# Altium schematic sheet PressureSensor.SchDoc
size Letter
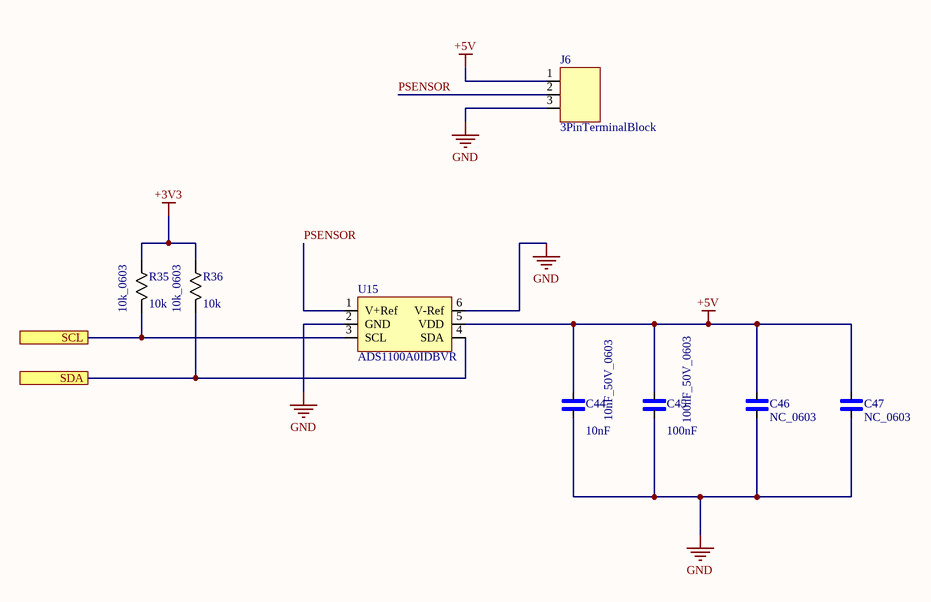
[diagram p0: PressureSensor.SchDoc]

## Parts
C44  10nF_50V_0603  Capacitance: 10nF  [0603]
C45  100nF_50V_0603  Capacitance: 100nF  [0603]
C46  NC_0603  [0603]
C47  NC_0603  [0603]
J6  3PinTerminalBlock  [3 POS 5mm Pitch]
R35  10k_0603  Resistance: 10k  [0603]
R36  10k_0603  Resistance: 10k  [0603]
U15  ADS1100A0IDBVR  [ADS1100A0IDBVR]

## Ports
SCL, SDA

## Nets
+3V3: R35.2 R36.2
+5V: C44.2 C45.2 C46.2 C47.2 J6.1 U15.5(VDD)
GND: C44.1 C45.1 C46.1 C47.1 J6.3 U15.2(GND) U15.6(V-Ref)
PSENSOR: J6.2 U15.1(V+Ref)
SCL: R35.1 U15.3(SCL) ; port SCL
SDA: R36.1 U15.4(SDA) ; port SDA

## Library data of the parts
C44 = 10nF_50V_0603: Manufacturer: Murata; Manufacturer Part Number: GRM188R71H103KA01D; Dielectric Material: Ceramic; Voltage Rating: 50V; Tolerance: 10%; Dielectric: X7R; Insulation Resistance: 10GR; Supplier 1: Digi-Key; Stock 1: 0; Pricing 1: 1=0.1, 10=0.06, 100=0.0266, 500=0.019 (USD); Mount: Surface Mount; Case/Package: 0603; Number of Pins: 2; Case Code (Metric): 1608; Case Code (Imperial): 0603; Material: Ceramic; Min Operating Temperature: -55°C; Max Operating Temperature: 125°C; Packaging: Tape and Reel; Voltage Rating (DC): 50V; Package Quantity: 1; Termination: SMD/SMT; Voltage: 50V; Length: 1.6mm; Height: 0.8mm; Width: 0.031inch; Thickness: 0.035inch; Depth: 0.8mm; REACH SVHC: Unknown; Lead Free: Lead Free; ComponentLink1URL: https://datasheet.ciiva.com/129/product-129872.pdf; ComponentLink1Description: https://datasheet.ciiva.com/129/product-129872.pdf; ComponentLink2URL: https://datasheet.ciiva.com/11786/0900766b8003061f-11786516.pdf; ComponentLink2Description: https://datasheet.ciiva.com/11786/0900766b8003061f-11786516.pdf; ComponentLink3URL: https://datasheet.ciiva.com/7937/4360-7937654.pdf; ComponentLink3Description: https://datasheet.ciiva.com/7937/4360-7937654.pdf; ComponentLink4URL: https://datasheet.ciiva.com/7937/1747461-7937655.pdf; ComponentLink4Description: https://datasheet.ciiva.com/7937/1747461-7937655.pdf; ComponentLink5URL: https://datasheet.ciiva.com/7937/1747461-7937656.pdf; ComponentLink5Description: https://datasheet.ciiva.com/7937/1747461-7937656.pdf; ComponentLink6URL: https://datasheet.ciiva.com/28534/1769893-28534235.pdf; ComponentLink6Description: https://datasheet.ciiva.com/28534/1769893-28534235.pdf; ComponentLink7URL: https://datasheet.ciiva.com/129/partnumbering-e-01-129870.pdf; ComponentLink7Description: https://datasheet.ciiva.com/129/partnumbering-e-01-129870.pdf; ComponentLink8URL: https://datasheet.ciiva.com/48428/nmgrm-data-en-48428590.pdf; ComponentLink8Description: https://datasheet.ciiva.com/48428/nmgrm-data-en-48428590.pdf; ComponentLink9URL: https://datasheet.ciiva.com/129/partnumbering-e-01-129871.pdf; ComponentLink9Description: https://datasheet.ciiva.com/129/partnumbering-e-01-129871.pdf; ComponentLink10URL: https://datasheet.ciiva.com/48428/nmgrm-data-en-48428591.pdf; ComponentLink10Description: https://datasheet.ciiva.com/48428/nmgrm-data-en-48428591.pdf; ComponentLink11URL: https://datasheet.ciiva.com/29202/451715-da-01-en-vs-kondensator-0603-29202047.pdf; ComponentLink11Description: https://datasheet.ciiva.com/29202/451715-da-01-en-vs-kondensator-0603-29202047.pdf; Supplier Part Number 1: 490-1512-1-ND
C45 = 100nF_50V_0603: Manufacturer: Murata; Manufacturer Part Number: GRM188R71H104KA93D; Material: Ceramic; Tolerance: 10%; Voltage Rating: 50V; Dielectric: X7R; Insulation Resistance: 10GR; Supplier 1: Digi-Key; Stock 1: 0; Pricing 1: 1=0.12, 10=0.084, 100=0.0396, 500=0.02778, 1000=0.023 (USD); Mount: Surface Mount; Case/Package: 0603; Number of Pins: 2; Case Code (Imperial): 0603; Case Code (Metric): 1608; Dielectric Material: Ceramic; Contact Plating: Tin,Matte; Min Operating Temperature: -55°C; Max Operating Temperature: 125°C; Packaging: Tape and Reel; Voltage Rating (DC): 50V; Package Quantity: 1; Termination: SMD/SMT; Voltage: 50V; Length: 1.6mm; Height: 0.8mm; Width: 0.8mm; Thickness: 0.035inch; Depth: 0.8mm; Radiation Hardening: No; REACH SVHC: No SVHC; Lead Free: Lead Free; ComponentLink1URL: https://datasheet.ciiva.com/19467/1857604-19467681.pdf; ComponentLink1Description: https://datasheet.ciiva.com/19467/1857604-19467681.pdf; ComponentLink2URL: https://datasheet.ciiva.com/28534/4360-28534245.pdf; ComponentLink2Description: https://datasheet.ciiva.com/28534/4360-28534245.pdf; ComponentLink3URL: https://datasheet.ciiva.com/26915/getdatasheetpartid-89095-26915384.pdf; ComponentLink3Description: https://datasheet.ciiva.com/26915/getdatasheetpartid-89095-26915384.pdf; ComponentLink4URL: https://datasheet.ciiva.com/131/partnumbering-e-01-131738.pdf; ComponentLink4Description: https://datasheet.ciiva.com/131/partnumbering-e-01-131738.pdf; ComponentLink5URL: https://datasheet.ciiva.com/7937/1747470-7937658.pdf; ComponentLink5Description: https://datasheet.ciiva.com/7937/1747470-7937658.pdf; ComponentLink6URL: https://datasheet.ciiva.com/14116/nmgrm-data-en-14116602.pdf; ComponentLink6Description: https://datasheet.ciiva.com/14116/nmgrm-data-en-14116602.pdf; ComponentLink7URL: https://datasheet.ciiva.com/131/partnumbering-e-01-131739.pdf; ComponentLink7Description: https://datasheet.ciiva.com/131/partnumbering-e-01-131739.pdf; ComponentLink8URL: https://datasheet.ciiva.com/7937/4360-7937659.pdf; ComponentLink8Description: https://datasheet.ciiva.com/7937/4360-7937659.pdf; ComponentLink9URL: https://datasheet.ciiva.com/48436/nmgrm-data-en-48436667.pdf; ComponentLink9Description: https://datasheet.ciiva.com/48436/nmgrm-data-en-48436667.pdf; ComponentLink10URL: https://datasheet.ciiva.com/131/partnumbering-e-01-131740.pdf; ComponentLink10Description: https://datasheet.ciiva.com/131/partnumbering-e-01-131740.pdf; ComponentLink11URL: https://datasheet.ciiva.com/11786/0900766b807a1cab-11786047.pdf; ComponentLink11Description: https://datasheet.ciiva.com/11786/0900766b807a1cab-11786047.pdf; ComponentLink12URL: https://datasheet.ciiva.com/29201/451744-da-01-en-vs-kondensator-0603-29201904.pdf; ComponentLink12Description: https://datasheet.ciiva.com/29201/451744-da-01-en-vs-kondensator-0603-29201904.pdf; Supplier Part Number 1: 490-1519-6-ND
J6 = 3PinTerminalBlock: 3 Position terminal block
R35 R36 = 10k_0603: Manufacturer: Panasonic; Manufacturer Part Number: ERJ-3EKF1002V; Tolerance: 1%; Max Power Dissipation: 100mW; Temperature Coefficient: 100ppm/°C; Voltage Rating: 75V; Supplier 1: Digi-Key; Stock 1: 0; Pricing 1: 5000=0.00751, 10000=0.00653, 25000=0.00573, 50000=0.00526, 125000=0.00515 (USD); Mount: Surface Mount; Case/Package: 0603; Number of Pins: 2; Case Code (Metric): 1608; Case Code (Imperial): 0603; Contact Plating: Tin; Min Operating Temperature: -55°C; Max Operating Temperature: 155°C; Packaging: Tape and Reel; Power Rating: 100mW; Package Quantity: 1; Termination: SMD/SMT; Composition: Thick Film; Number of Terminations: 2; Military Standard: Not; Voltage Rating (DC): 75V; Length: 1.6mm; Height: 0.45mm; Depth: 0.8mm; Width: 0.031inch; Radiation Hardening: No; Lead Free: Lead Free; REACH SVHC: No SVHC; ComponentLink1URL: https://datasheet.ciiva.com/16511/aoa0000ce2-16511861.pdf; ComponentLink1Description: https://datasheet.ciiva.com/16511/aoa0000ce2-16511861.pdf; ComponentLink2URL: https://datasheet.ciiva.com/46372/1678782-46372725.pdf; ComponentLink2Description: https://datasheet.ciiva.com/46372/1678782-46372725.pdf; ComponentLink3URL: https://datasheet.ciiva.com/28514/426256-28514198.pdf; ComponentLink3Description: https://datasheet.ciiva.com/28514/426256-28514198.pdf; ComponentLink4URL: https://datasheet.ciiva.com/9194/aoa0000ce2-9194199.pdf; ComponentLink4Description: https://datasheet.ciiva.com/9194/aoa0000ce2-9194199.pdf; ComponentLink5URL: https://datasheet.ciiva.com/7830/aoa0000ce2-7830729.pdf; ComponentLink5Description: https://datasheet.ciiva.com/7830/aoa0000ce2-7830729.pdf; ComponentLink6URL: https://datasheet.ciiva.com/17212/aoa0000ce2-17212105.pdf; ComponentLink6Description: https://datasheet.ciiva.com/17212/aoa0000ce2-17212105.pdf; ComponentLink7URL: https://datasheet.ciiva.com/30208/aoa0000ce2-30208985.pdf; ComponentLink7Description: https://datasheet.ciiva.com/30208/aoa0000ce2-30208985.pdf; ComponentLink8URL: https://datasheet.ciiva.com/48530/aoa0000ce2-48530988.pdf; ComponentLink8Description: https://datasheet.ciiva.com/48530/aoa0000ce2-48530988.pdf; ComponentLink9URL: https://datasheet.ciiva.com/24070/aoa0000ce2-24070318.pdf; ComponentLink9Description: https://datasheet.ciiva.com/24070/aoa0000ce2-24070318.pdf; ComponentLink10URL: https://datasheet.ciiva.com/16759/70260748-16759807.pdf; ComponentLink10Description: https://datasheet.ciiva.com/16759/70260748-16759807.pdf; Supplier Part Number 1: P10.0KHTR-ND
U15 = ADS1100A0IDBVR: Self-Calibrating, 16-Bit Analog-to-Digital Converter 6-SOT-23 -40 to 85